# EAGLE design transmit (EAGLE 5.12)
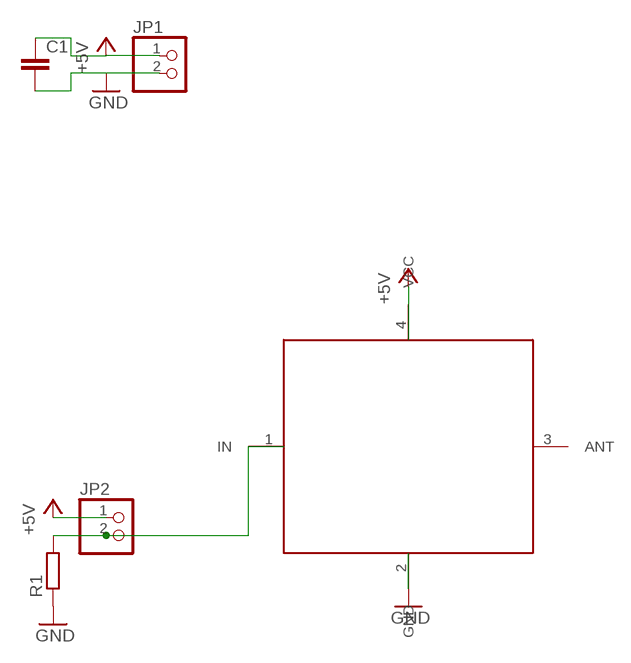
[diagram p0: schematic, sheet 1]

## Parts
C1  C-EUC0805  [C0805]
JP1  PINHD-1X2  [1X02]
JP2  PINHD-1X2  [1X02]
R1  R-EU_R0805  [R0805]
U$1  QAM-TX3  [QAM-TX3]

## Nets
+5V: C1.1 JP1.1 JP2.1 U$1.4(VCC)
GND: C1.2 JP1.2 R1.1 U$1.2(GND)
N$2: JP2.2 R1.2 U$1.1(IN)
Unconnected: U$1.3(ANT)

## Library data of the parts
C1 = rcl:C-EU: CAPACITOR, European symbol
JP1 JP2 = pinhead:PINHD-1X2: PIN HEADER
R1 = resistor:R-EU_: RESISTOR, European symbol
U$1 = qusar:QAM-TX3

## Board
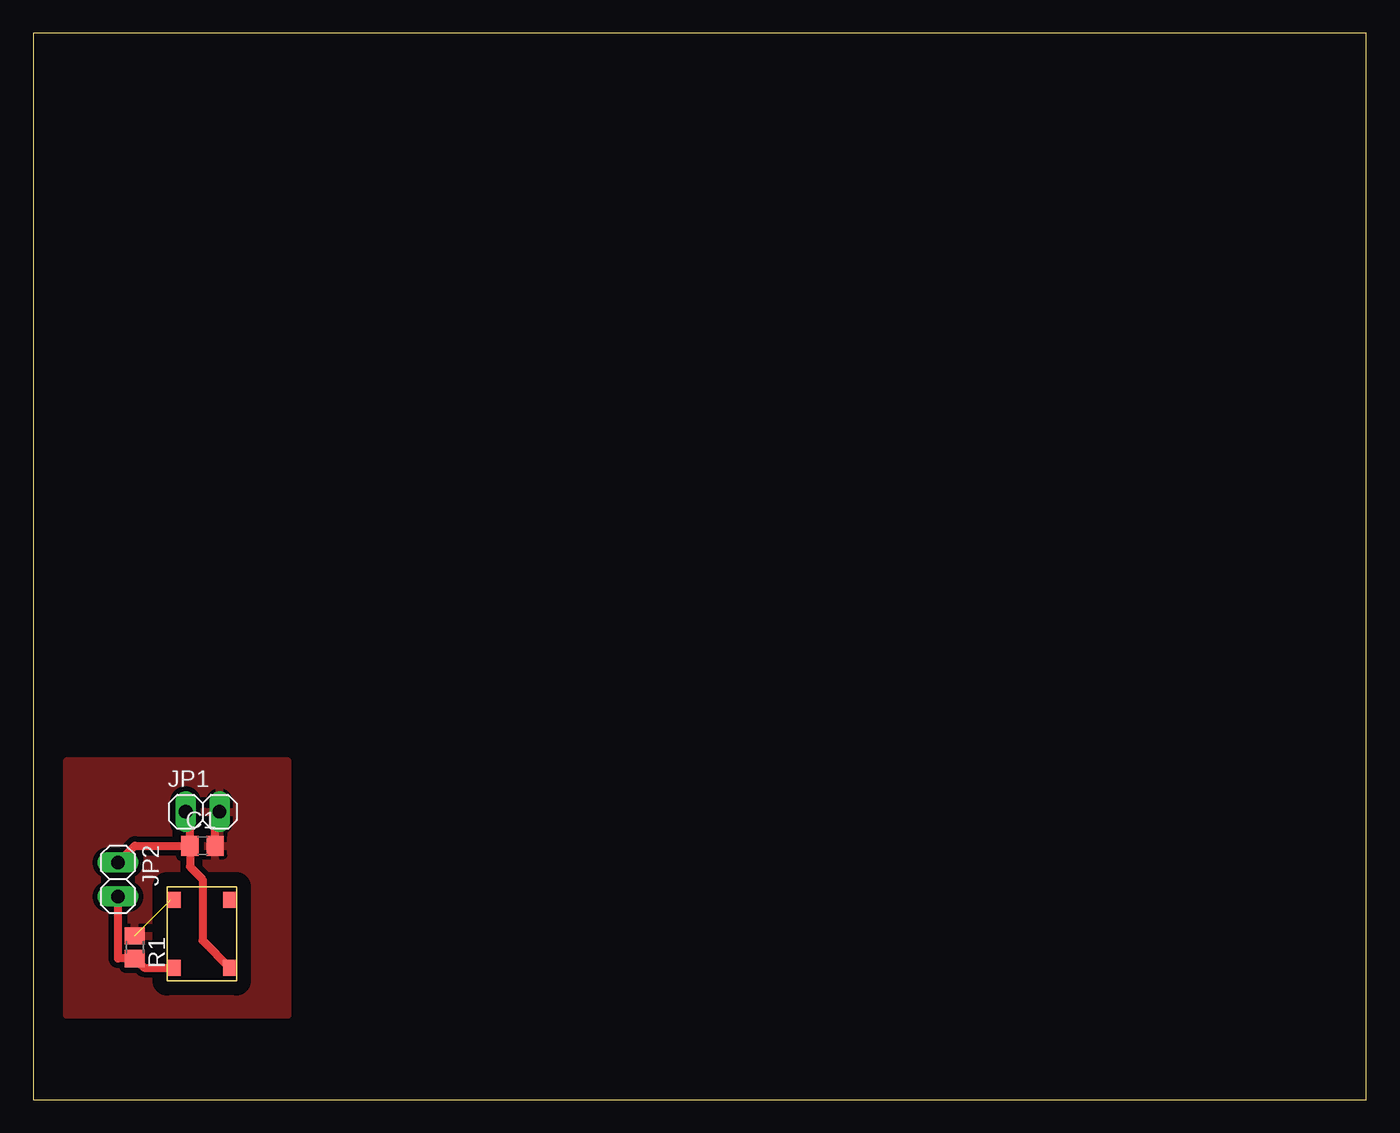
[diagram p1: board, top side]

Size 100 x 80 mm. Coordinates in mm from the lower left corner, seen from the top.
Outline: 0,0 100,0 100,80 0,80 0,0
Copper layers (1*16): Top 0.035mm / dielectric 1.5mm / Bottom 0.035mm
Design rules "default": minimum track width 10mil, minimum drill 24mil, track to track 8mil, track to pad 8mil, pad to pad 8mil, via to via 8mil, smd to smd 8mil, copper to edge 40mil, drill to drill 8mil, minimum pad ring 10mil, minimum via ring 8mil, stop-mask expansion 4mil, vias tented up to drill 0mil, thermal gap 10mil

### Footprints (pad centres in the part's own frame; a part is rotated, then mirrored left to right if it is on the bottom)
C0805 = smd 1.3 x 1.5: 1 -0.95,0; 2 0.95,0
1X02 = drill 1.016 long: 1 -1.27,0; 2 1.27,0
R0805 = smd 1.3 x 1.5: 1 -0.85,0; 2 0.85,0
QAM-TX3 = smd 1.2 x 1: 1 1,4.7; 2 6.08,4.7; 3 6.08,0.5; 4 1,0.5

### Placement (x,y rotation side)
C1  12.7,19.05 0 top
JP1  12.7,21.59 0 top
JP2  6.35,16.51 270 top
R1  7.62,11.43 270 top
U$1  15.24,8.89 90 top

### Tracks (layer width: path | path; a pad name or v marks a point on that pad's centre or on a via)
+5V
  Top 0.61: JP1.1 11.75,21.27 C1.1 | JP2.1 7.62,19.05 C1.1 | C1.1 11.75,17.46 12.7,16.51 12.7,11.93 U$1.4
GND  (1 unrouted)
  Top 0.61: JP1.2 13.65,21.27 C1.2 | U$1.2 10.31,14.97
  pour Top (isolate 0.406): 2.54,25.4 19.05,25.4 19.05,6.35 2.54,6.35
N$2
  Top 0.61: JP2.2 6.35,10.58 R1.2 8.31,9.89 U$1.1